# EAGLE design KnobBox_v1 (EAGLE 7.5.0)
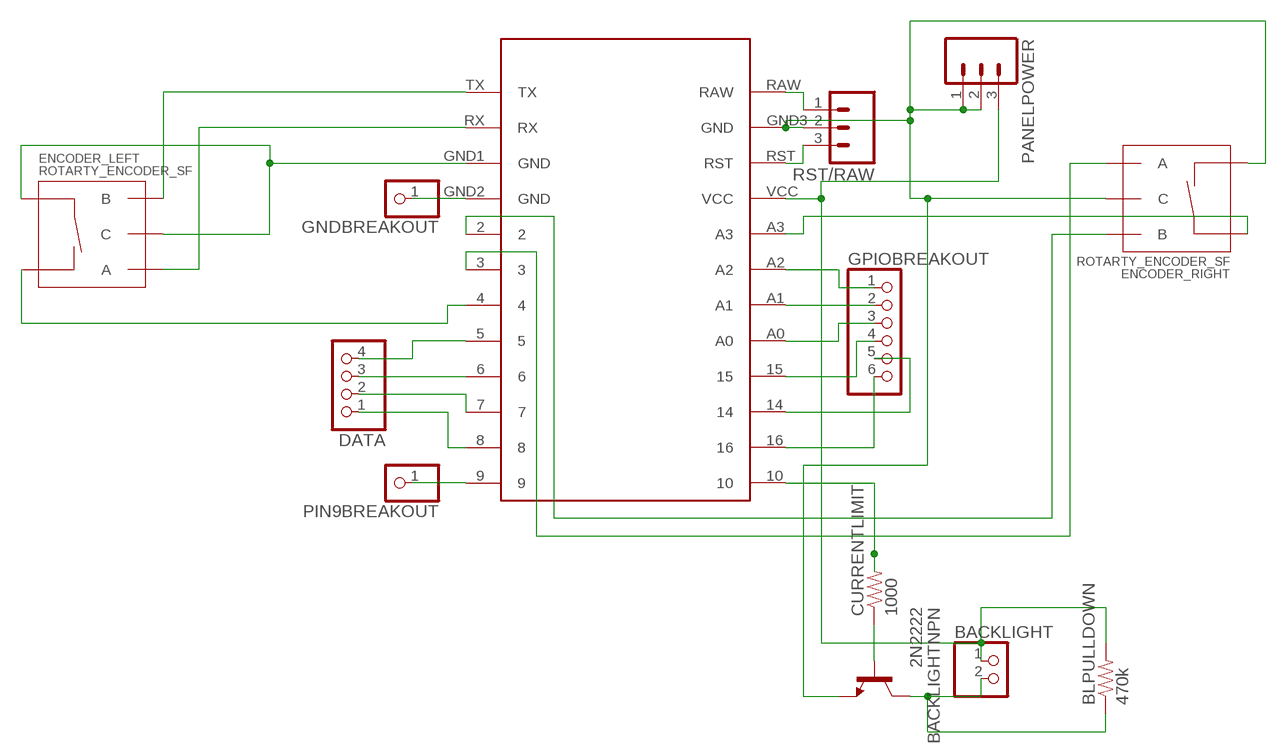
[diagram p0: schematic, sheet 1]

## Parts
BACKLIGHT  PINHD-1X2  [1X02]
BACKLIGHTNPN  2N2222  [TO92-EBC-OVAL]
BLPULLDOWN  470k  RESISTORPTH-1/4W  [AXIAL-0.4]
CURRENTLIMIT  1000  RESISTORPTH-1/4W  [AXIAL-0.4]
DATA  PINHD-1X4  [1X04]
ENCODER_LEFT  ROTARTY_ENCODER_SF  [ROTARY_ENC_SF_MOD]
ENCODER_RIGHT  ROTARTY_ENCODER_SF  [ROTARY_ENC_SF_MOD]
GNDBREAKOUT  PINHD-1X1BIG  [1X01_MOD]
GPIOBREAKOUT  PINHD-1X6  [1X06]
PANELPOWER  M03PTH  [1X03]
PIN9BREAKOUT  PINHD-1X1BIG  [1X01_MOD]
PROMICRO  PROMICROROUND  [PROMICRO]
RST/RAW  M03PTH  [1X03]

## Nets
N$1: ENCODER_LEFT.B PROMICRO.TX
N$2: ENCODER_LEFT.A PROMICRO.RX
N$3: ENCODER_RIGHT.A PROMICRO.3
N$4: ENCODER_RIGHT.B PROMICRO.2
N$5: BACKLIGHTNPN.E ENCODER_RIGHT.C ENCODER_RIGHT.SW- PANELPOWER.1 PANELPOWER.2 PROMICRO.GND3(GND) RST/RAW.2
N$6: ENCODER_LEFT.C ENCODER_LEFT.SW+ PROMICRO.GND1(GND)
N$7: ENCODER_LEFT.SW- PROMICRO.4
N$8: ENCODER_RIGHT.SW+ PROMICRO.A3
N$9: DATA.4 PROMICRO.5
N$10: DATA.3 PROMICRO.6
N$11: DATA.2 PROMICRO.7
N$12: DATA.1 PROMICRO.8
N$13: CURRENTLIMIT.P$2 PROMICRO.10
N$14: BACKLIGHTNPN.B CURRENTLIMIT.P$1
N$15: BACKLIGHT.1 BLPULLDOWN.P$2 PANELPOWER.3 PROMICRO.VCC
N$16: BACKLIGHT.2 BACKLIGHTNPN.C BLPULLDOWN.P$1
N$17: GPIOBREAKOUT.1 PROMICRO.A2
N$18: GPIOBREAKOUT.2 PROMICRO.A1
N$19: GPIOBREAKOUT.3 PROMICRO.A0
N$20: GPIOBREAKOUT.4 PROMICRO.15
N$21: GPIOBREAKOUT.5 PROMICRO.14
N$22: GPIOBREAKOUT.6 PROMICRO.16
N$23: PIN9BREAKOUT.1 PROMICRO.9
N$24: PROMICRO.RAW RST/RAW.1
N$25: PROMICRO.RST RST/RAW.3
N$26: GNDBREAKOUT.1 PROMICRO.GND2(GND)

## Library data of the parts
BACKLIGHT = pinhead:PINHD-1X2: PIN HEADER
BACKLIGHTNPN = adafruit:2N2222: NPN TRANSISTOR Big oval pads
BLPULLDOWN CURRENTLIMIT = SparkFun-Passives:RESISTOR: Resistor Basic schematic elements and footprints for 0603, 1206, and PTH resistors.
DATA = pinhead:PINHD-1X4: PIN HEADER
ENCODER_LEFT ENCODER_RIGHT = Ryans_Library:ROTARTY_ENCODER_SF: Simple no LED rotary encoder Example: COM-09117
GNDBREAKOUT PIN9BREAKOUT = Ryans_Library:PINHD-1X1: PIN HEADER
GPIOBREAKOUT = pinhead:PINHD-1X6: PIN HEADER
PANELPOWER RST/RAW = SparkFun-Connectors:M03: Header 3 Standard 3-pin 0.1" header. Use with straight break away headers (SKU : PRT-00116), right angle break away headers (PRT-00553), swiss pins (PRT-00743), machine pins (PRT-00117), and female headers (PRT-00115). Molex polarized connector foot print use with SKU : PRT-08232 with associated crimp pins and housings.
PROMICRO = Ryans_Library:PROMICRO

## Board
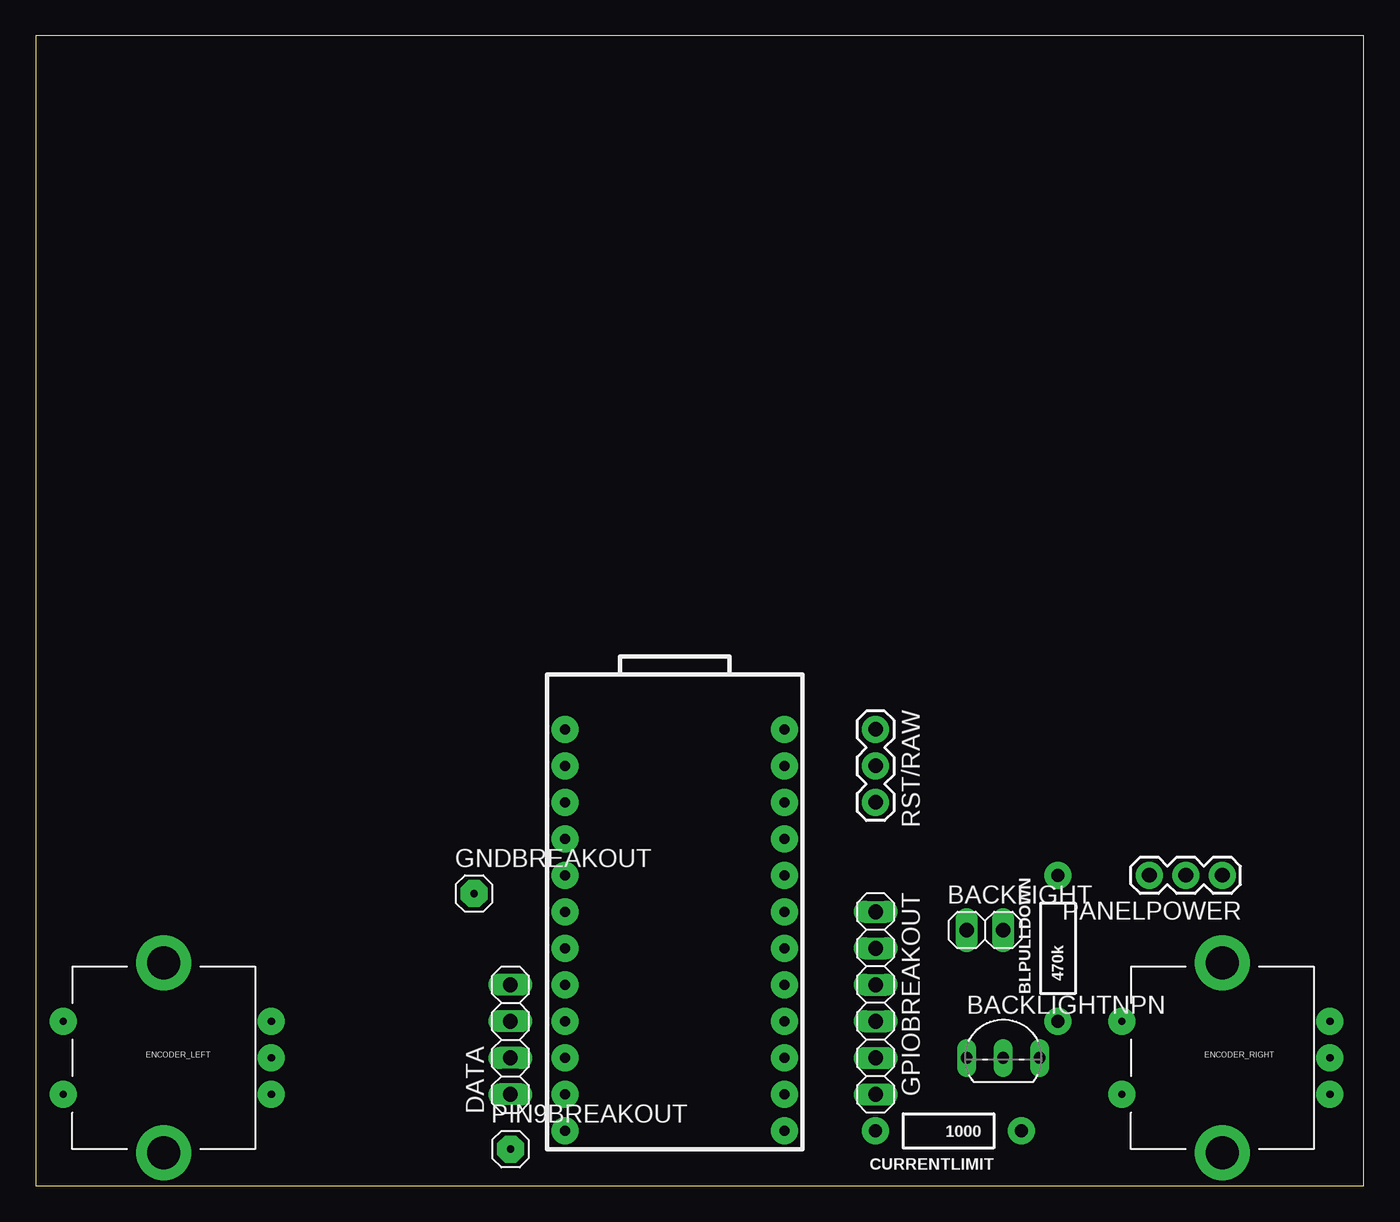
[diagram p1: board, top side]
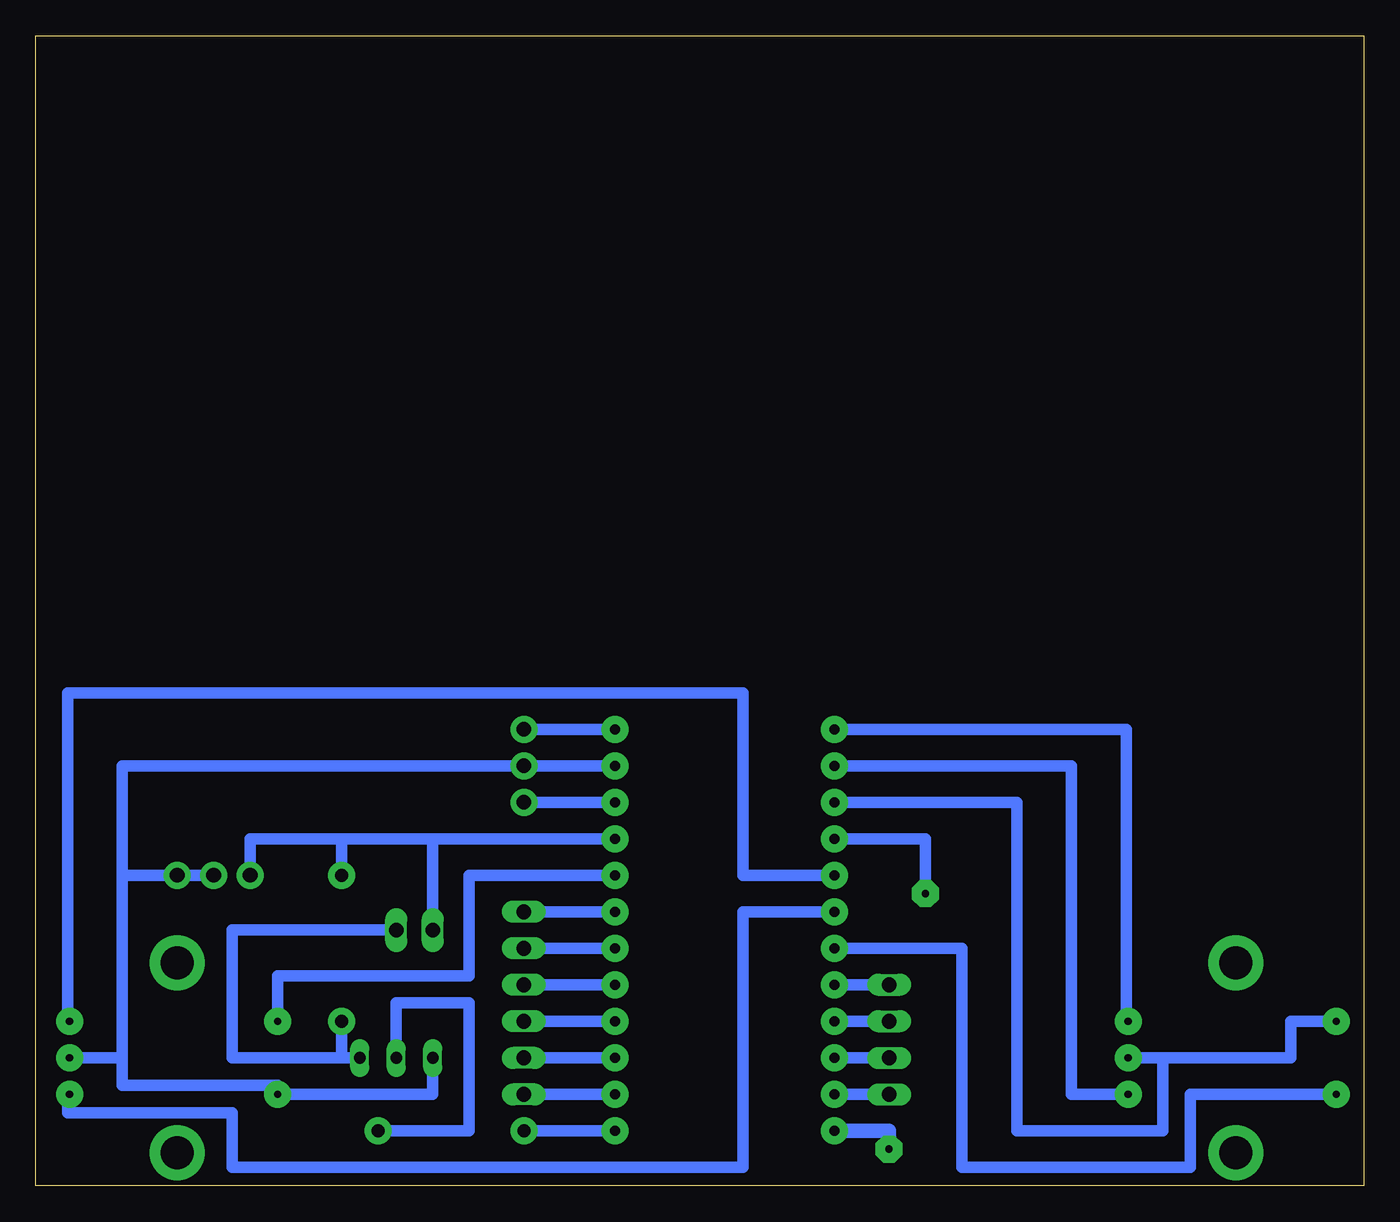
[diagram p2: board, bottom side, seen from below]

Size 92.38 x 80 mm. Coordinates in mm from the lower left corner, seen from the top.
Outline: 0,0 92.38,0 92.38,80 0,80 0,0
Copper layers (1*16): Top 0.035559375mm / dielectric 1.501140625mm / Bottom 0.035559375mm
Design rules "typical_4pcb": minimum track width 10mil, minimum drill 15mil, track to track 6mil, track to pad 6mil, pad to pad 6mil, via to via 6mil, smd to smd 6mil, copper to edge 15mil, drill to drill 8mil, minimum pad ring 10mil, minimum via ring 8mil, stop-mask expansion 4mil, vias tented up to drill 0mil, thermal gap 10mil

### Footprints (pad centres in the part's own frame; a part is rotated, then mirrored left to right if it is on the bottom)
1X02 = drill 1.016 long: 1 -1.27,0; 2 1.27,0
TO92-EBC-OVAL = drill 0.813 long: B 0,-1.27; C 2.54,-1.27; E -2.54,-1.27
AXIAL-0.4 = drill 0.9 pad 1.88: P$1 -5.08,0; P$2 5.08,0
1X04 = drill 1.016 long: 1 -3.81,0; 2 -1.27,0; 3 1.27,0; 4 3.81,0
ROTARY_ENC_SF_MOD = drill 0.5 pad 1.88: A 7.493,-2.54; B 7.493,2.54; C 7.493,0; SW+ -6.985,2.54; SW- -6.985,-2.54 | drill 2.286 pad 3.81: P$3 0,6.604; P$4 0,-6.604
1X01_MOD = drill 0.5 pad 1.88 octagon: 1 0,0
1X06 = drill 1.016 long: 1 -6.35,0; 2 -3.81,0; 3 -1.27,0; 4 1.27,0; 5 3.81,0; 6 6.35,0
1X03 = drill 1.016 pad 1.88: 1 0,0; 2 2.54,0; 3 5.08,0
PROMICRO = drill 0.7 pad 1.88: 2 -6.35,-2.54; 3 -6.35,-5.08; 4 -6.35,-7.62; 5 -6.35,-10.16; 6 -6.35,-12.7; 7 -6.35,-15.24; 8 -6.35,-17.78; 9 -6.35,-20.32; 10 8.89,-20.32; 14 8.89,-15.24; 15 8.89,-12.7; 16 8.89,-17.78; A0 8.89,-10.16; A1 8.89,-7.62; A2 8.89,-5.08; A3 8.89,-2.54; GND1 -6.35,2.54; GND2 -6.35,0; GND3 8.89,5.08; RAW 8.89,7.62; RST 8.89,2.54; RX -6.35,5.08; TX -6.35,7.62; VCC 8.89,0

### Placement (x,y rotation side)
BACKLIGHT  66.04,17.78 0 top
BACKLIGHTNPN  67.31,10.16 0 top
BLPULLDOWN  71.12,16.51 90 top
CURRENTLIMIT  63.5,3.81 180 top
DATA  33.02,10.16 90 top
ENCODER_LEFT  8.89,8.89 0 top
ENCODER_RIGHT  82.55,8.89 0 top
GNDBREAKOUT  30.48,20.32 0 top
GPIOBREAKOUT  58.42,12.7 270 top
PANELPOWER  82.55,21.59 180 top
PIN9BREAKOUT  33.02,2.54 0 top
PROMICRO  43.18,24.13 0 top
RST/RAW  58.42,31.75 270 top

### Tracks (layer width: path | path; a pad name or v marks a point on that pad's centre or on a via)
N$1
  Bottom 0.813: ENCODER_LEFT.B 16.51,11.43 16.51,31.75 PROMICRO.TX
N$2
  Bottom 0.813: ENCODER_LEFT.A 20.32,6.35 20.32,29.21 PROMICRO.RX
N$3
  Bottom 0.813: ENCODER_RIGHT.A 90.17,6.35 90.17,5.08 78.74,5.08 78.74,1.27 43.18,1.27 43.18,19.05 PROMICRO.3
N$4
  Bottom 0.813: ENCODER_RIGHT.B 90.17,11.43 90.17,34.29 43.18,34.29 43.18,21.59 PROMICRO.2
N$5
  Bottom 0.813: PROMICRO.GND3 RST/RAW.2 86.36,29.21 86.36,21.59 | 86.36,21.59 86.36,8.89 | ENCODER_RIGHT.C 86.36,8.89 | 86.36,8.89 86.36,6.99 75.56,6.99 ENCODER_RIGHT.SW- 64.77,6.35 BACKLIGHTNPN.E | PANELPOWER.1 PANELPOWER.2 86.36,21.59
N$6
  Bottom 0.813: ENCODER_LEFT.SW+ 5.08,11.43 5.08,8.89 13.97,8.89 | 13.97,8.89 ENCODER_LEFT.C | PROMICRO.GND1 24.13,26.67 24.13,3.81 13.97,3.81 13.97,8.89
N$7
  Bottom 0.813: ENCODER_LEFT.SW- 12.06,6.35 12.06,1.27 27.94,1.27 27.94,16.51 PROMICRO.4
N$8
  Bottom 0.813: ENCODER_RIGHT.SW+ 75.56,14.61 62.23,14.61 62.23,21.59 PROMICRO.A3
N$9
  Bottom 0.813: PROMICRO.5 DATA.4
N$10
  Bottom 0.813: PROMICRO.6 DATA.3
N$11
  Bottom 0.813: PROMICRO.7 DATA.2
N$12
  Bottom 0.813: PROMICRO.8 DATA.1
N$13
  Bottom 0.813: PROMICRO.10 CURRENTLIMIT.P$2
N$14
  Bottom 0.813: BACKLIGHTNPN.B 67.31,12.7 62.23,12.7 62.23,3.81 CURRENTLIMIT.P$1
N$15
  Bottom 0.813: PROMICRO.VCC 64.77,24.13 | 64.77,24.13 71.12,24.13 | BLPULLDOWN.P$2 71.12,24.13 | BACKLIGHT.1 64.77,24.13 | 71.12,24.13 77.47,24.13 PANELPOWER.3
N$16
  Bottom 0.813: BACKLIGHT.2 78.74,17.78 78.74,8.89 71.12,8.89 | 71.12,8.89 BACKLIGHTNPN.C | BLPULLDOWN.P$1 71.12,8.89
N$17
  Bottom 0.813: PROMICRO.A2 GPIOBREAKOUT.1
N$18
  Bottom 0.813: PROMICRO.A1 GPIOBREAKOUT.2
N$19
  Bottom 0.813: PROMICRO.A0 GPIOBREAKOUT.3
N$20
  Bottom 0.813: PROMICRO.15 GPIOBREAKOUT.4
N$21
  Bottom 0.813: PROMICRO.14 GPIOBREAKOUT.5
N$22
  Bottom 0.813: PROMICRO.16 GPIOBREAKOUT.6
N$23
  Bottom 1.016: PROMICRO.9 33.02,3.81 PIN9BREAKOUT.1
N$24
  Bottom 0.813: PROMICRO.RAW RST/RAW.1
N$25
  Bottom 0.813: PROMICRO.RST RST/RAW.3
N$26
  Bottom 0.813: PROMICRO.GND2 30.48,24.13 GNDBREAKOUT.1